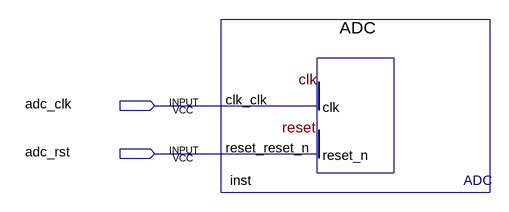
[diagram p0: schematic sheet]
// Quartus schematic ADC.bdf as structural Verilog: 1 symbols, 2 pins
module ADC (
  input  adc_clk,
  input  adc_rst
);

  ADC inst (.clk_clk(adc_clk), .reset_reset_n(adc_rst));
endmodule
